# EAGLE design EV_Display_Schematic (EAGLE 9.6.2)
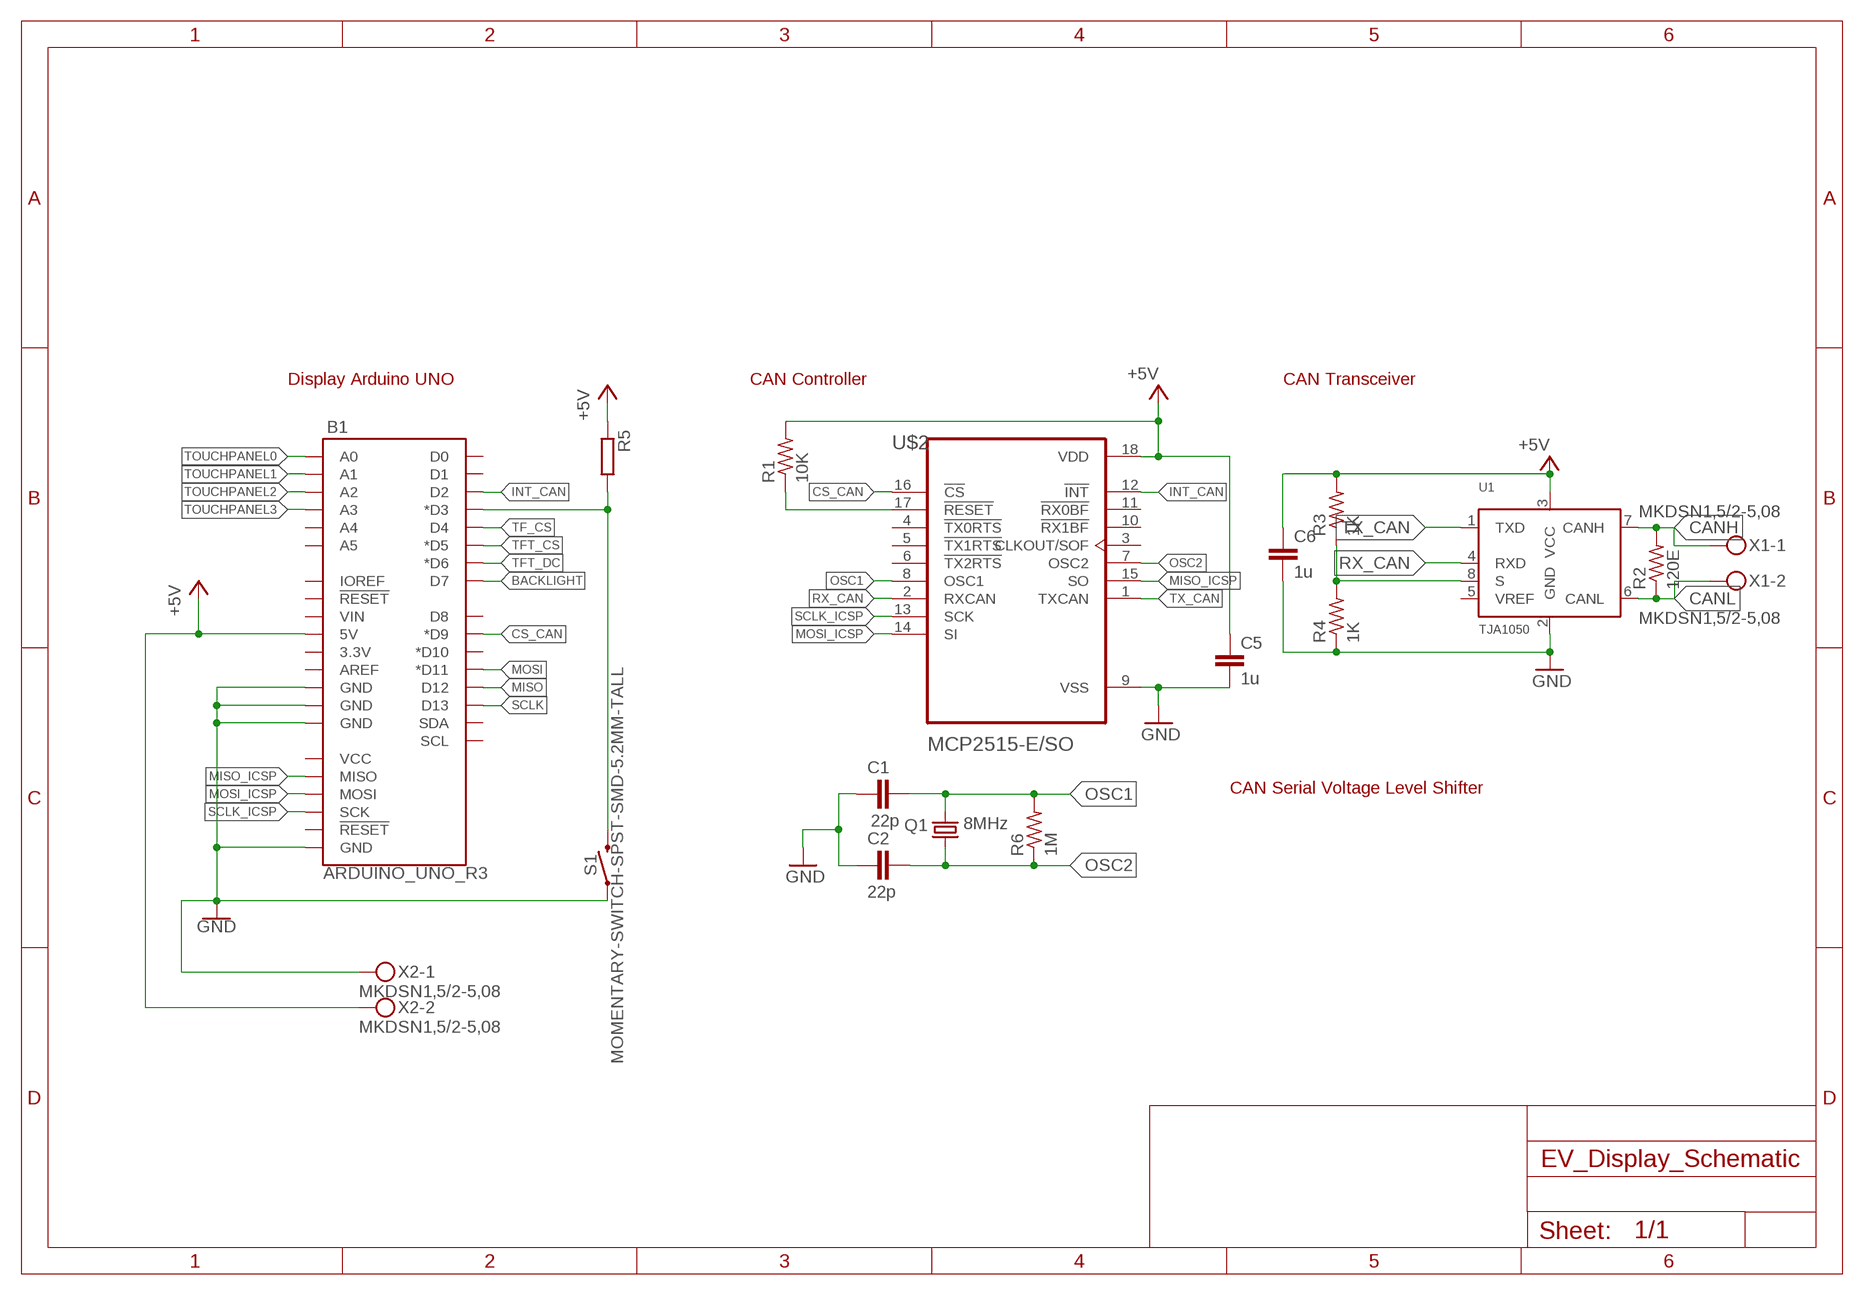
[diagram p0: schematic, sheet 1]

## Parts
B1  ARDUINO_UNO_R3  [ARDUINO_R3]
C1  22p  C-EUC0805  [C0805]
C2  22p  C-EUC0805  [C0805]
C5  1u  C-EUC0805  [C0805]
C6  1u  C-EUC0805  [C0805]
Q1  8MHz  CRYSTALHC49S  [HC49/S]
R1  10K  R-US_R0805  [R0805]
R2  120E  R-US_R0805  [R0805]
R3  1K  R-US_R0805  [R0805]
R4  1K  R-US_R0805  [R0805]
R5  R-EU_R0805  [R0805]
R6  1M  R-US_R0805  [R0805]
S1  MOMENTARY-SWITCH-SPST-SMD-5.2MM-TALL  [TACTILE_SWITCH_SMD_5.2MM]
U1  TJA1050  [SOT96-1]
U$2  MCP2515-E/SO  [SOIC127P1030X265-18N]
X1  MKDSN1,5/2-5,08  [MKDSN1,5/2-5,08]
X2  MKDSN1,5/2-5,08  [MKDSN1,5/2-5,08]

## Nets
+5V [Power]: B1.5V C5.1 C6.1 R1.2 R3.2 R5.1 U1.3(VCC) U$2.18(VDD) X2.2
BACKLIGHT: B1.D7
CANH: R2.2 U1.7(CANH) X1.1
CANL: R2.1 U1.6(CANL) X1.2
CS_CAN: B1.D9(*D9) U$2.16(!CS)
GND: B1.GND@1(GND) B1.GND@2(GND) B1.GND@3(GND) B1.GND@4(GND) C1.1 C2.1 C5.2 C6.2 R4.1 S1.1 U1.2(GND) U$2.9(VSS) X2.1
INT_CAN: B1.D2 U$2.12(!INT)
MISO: B1.D12
MISO_ICSP: B1.MISO U$2.15(SO)
MOSI: B1.D11(*D11)
MOSI_ICSP: B1.MOSI U$2.14(SI)
N$1: R1.1 U$2.17(!RESET)
N$2: R3.1 R4.2 U1.8(S)
N$3: B1.D3(*D3) R5.2 S1.3
OSC1: C1.2 Q1.2 R6.2 U$2.8(OSC1)
OSC2: C2.2 Q1.1 R6.1 U$2.7(OSC2)
RX_CAN: U1.4(RXD) U$2.2(RXCAN)
SCLK: B1.D13
SCLK_ICSP: B1.SCK U$2.13(SCK)
TF_CS: B1.D4
TFT_CS: B1.D5(*D5)
TFT_DC: B1.D6(*D6)
TOUCHPANEL0: B1.A0
TOUCHPANEL1: B1.A1
TOUCHPANEL2: B1.A2
TOUCHPANEL3: B1.A3
TX_CAN: U1.1(TXD) U$2.1(TXCAN)
Unconnected: B1.3.3V B1.A4 B1.A5 B1.AREF B1.D0 B1.D1 B1.D8 B1.D10(*D10) B1.IOREF B1.RESET@1(!RESET!) B1.RESET@2(!RESET!) B1.SCL B1.SDA B1.VCC B1.VIN U1.5(VREF) U$2.3(CLKOUT/SOF) U$2.4(!TX0RTS) U$2.5(!TX1RTS) U$2.6(!TX2RTS) U$2.10(!RX1BF) U$2.11(!RX0BF)

## Notes on the sheet
- Display Arduino UNO | CAN Controller | CAN Transceiver
- CAN Serial Voltage Level Shifter

## Library data of the parts
B1 = SparkFun-Boards:ARDUINO_UNO_R3: Arduino R3 Footprint with SPI header Arduino Uno R3 Compatible Footprint. Matches PCB size of the original board. SparkFun Products: SAMD21 Dev Breakout <https://www.sparkfun.com/products/13672> RedBoard <https://www.sparkfun.com/products/12757> R3 Stackable Headers <https://www.sparkfun.com/products/11417>
C1 C2 C5 C6 = rcl:C-EU: CAPACITOR, European symbol; SPICEPREFIX: C
Q1 = crystal:CRYSTAL: CRYSTAL; OC_FARNELL: 1667008; OC_NEWARK: unknown
R1-R4 R6 = rcl:R-US_: RESISTOR, American symbol; SPICEPREFIX: R
R5 = rcl:R-EU_: RESISTOR, European symbol; SPICEPREFIX: R
S1 = SparkFun-Switches:MOMENTARY-SWITCH-SPST: Momentary Switch (Pushbutton) - SPST Normally-open (NO) SPST momentary switches (buttons, pushbuttons). Variants PTH-12MM - 12mm square, through-hole Momentary Pushbutton Switch - 12mm Square <https://www.sparkfun.com/products/9190> (COM-09190) PTH-6.0MM, PTH-6.0MM-KIT - 6.0mm square, through-hole Mini Pushbutton Switch <https://www.sparkfun.com/products/97> (COM-00097) KIT package intended for soldering kit's - only one side of pads' copper is exposed. PTH-RIGHT-ANGLE-KIT - Right-angle, through-hole Right Angle Tactile Button <https://www.sparkfun.com/products/10791> - Used on SparkFun BigTime Watch Kit <https://www.sparkfun.com/products/11734> SMD-12MM - 12mm square, surface-mount Tactile Button - SMD (12mm) <https://www.sparkfun.com/products/12993> (COM-12993) Used on SparkFun PicoBoard <https://www.sparkfun.com/products/11888> SMD-4.5MM - 4.5mm Square Trackball Switch Used on SparkFun Blackberry Trackballer Breakout <https://www.sparkfun.com/products/13169> SMD-4.6MMX2.8MM - 4.60mm x 2.80mm, surface mount Used on SparkFun SAMD21 Mini Breakout <https://www.sparkfun.com/products/13664> SMD-5.2MM, SMD-5.2-REDUNDANT - 5.2mm square, surface-mount Mini Pushbutton Switch - SMD <https://www.sparkfun.com/products/8720> (COM-08720) Used on Arduino Pro Mini <https://www.sparkfun.com/products/11114> REDUNDANT package connects both switch circuits together SMD-6.0X3.5MM - 6.0 x 3.5mm, surface mount Momentary Reset Switch SMD <https://www.sparkfun.com/products/8229> (COM-08229) SMD-6.2MM-TALL - 6.2mm square, surface mount Tactile Button - SMD (6mm) <https://www.sparkfun.com/products/12992> Used on SparkFun Digital Sandbox <https://www.sparkfun.com/products/12651> SMD-RIGHT-ANGLE - Right-angle, surface mount Used on SparkFun Block for Intel® Edison - Arduino <https://www.sparkfun.com/products/13036>; PROD_ID: SWCH-14139
U1 = TJA1050:TJA1050: High speed CAN transceiver The TJA1050 is the interface between the Controller Area Network (CAN) protocol controller and the physical bus. The device provides differential transmit capability to the bus and differential receive capability to the CAN controller. The TJA1050 is the third Philips high-speed CAN transceiver after the PCA82C250 and the PCA82C251. The most important differences are: Much lower electromagnetic emission due to optimal matching of the output signals CANH and CANL Improved behaviour in case of an unpowered node No standby mode. This makes the TJA1050 eminently suitable for use in nodes that are in a power-down situation in partially powered networks. AAL Eindhoven MK; AVAILABILITY: Unavailable; DESCRIPTION: 1/1 Transceiver Half CANbus 8-SO; MF: NXP USA; MP: TJA1050; PACKAGE: SOIC-8 NXP USA; PRICE: None
U$2 = MCP2515-E_SO:MCP2515-E/SO; AVAILABILITY: Unavailable; DESCRIPTION: CANbus Controller CAN 2.0 SPI Interface 18-SOIC; MF: Microchip; MP: MCP2515-E/SO; PACKAGE: SOIC-18 Microchip; PRICE: None
X1 X2 = con-phoenix-508:MKDSN1,5/2-5,08: MKDSN 1,5/ 2-5,08 Printklemme Nennstrom: 13,5 A Nennspannung: 250 V Rastermaß: 5,08 mm Polzahl: 2 Anschlussart: Schraubanschluss Montage: Löten Anschlussrichtung Leiter/Platine: 0 ° Artikelnummer: 1729128 Source: http://eshop.phoenixcontact.com .. 1729128.pdf

## Net classes
0 default: width 0.305 mm, clearance 0.203 mm
1 Power: width 0.508 mm, clearance 0.406 mm

## Board
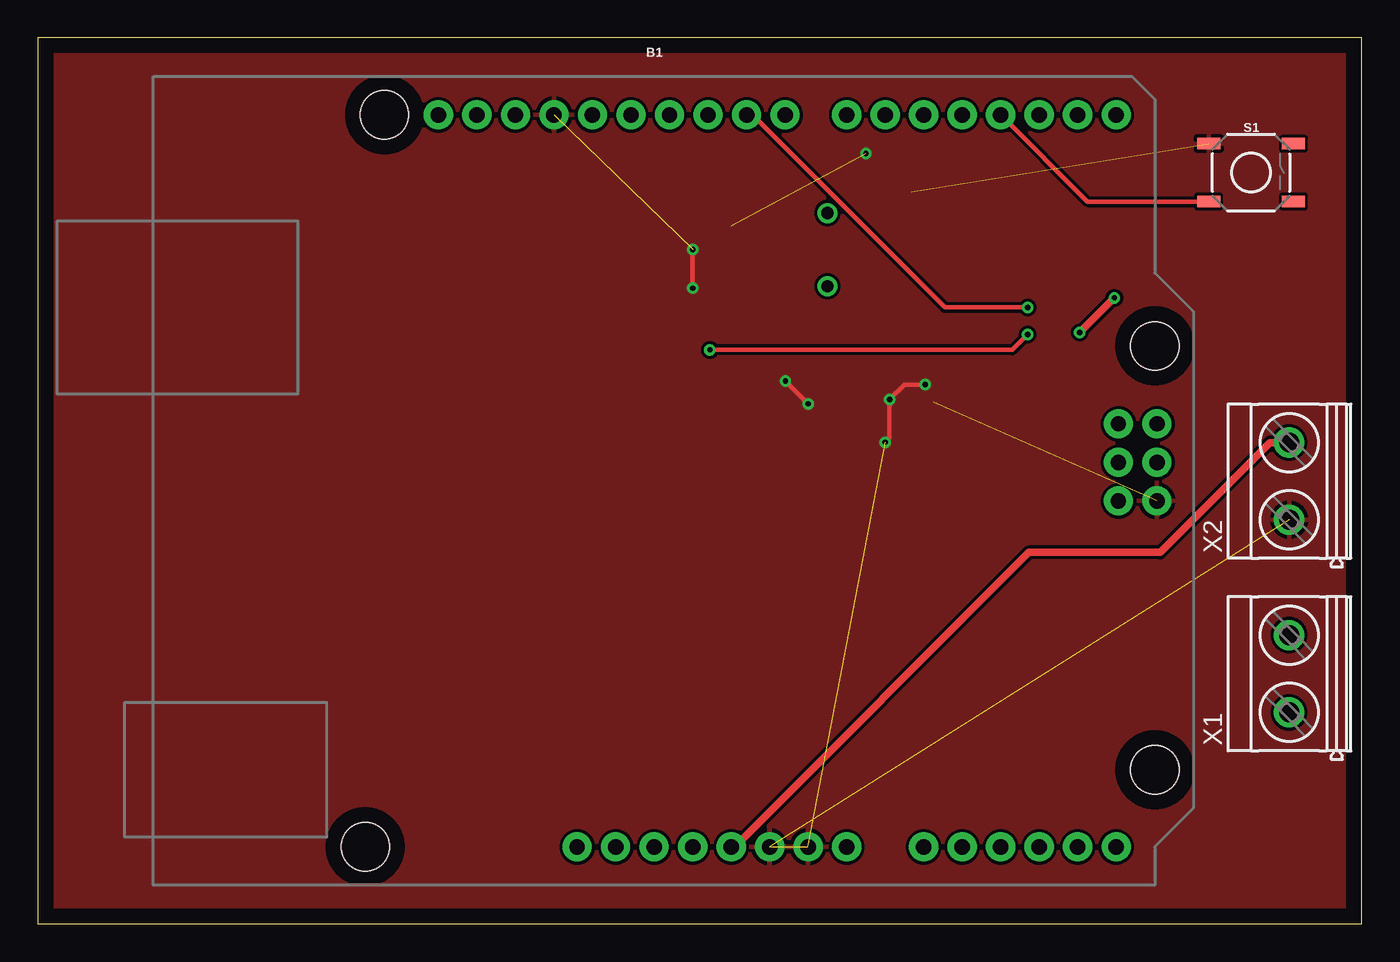
[diagram p1: board, top side]
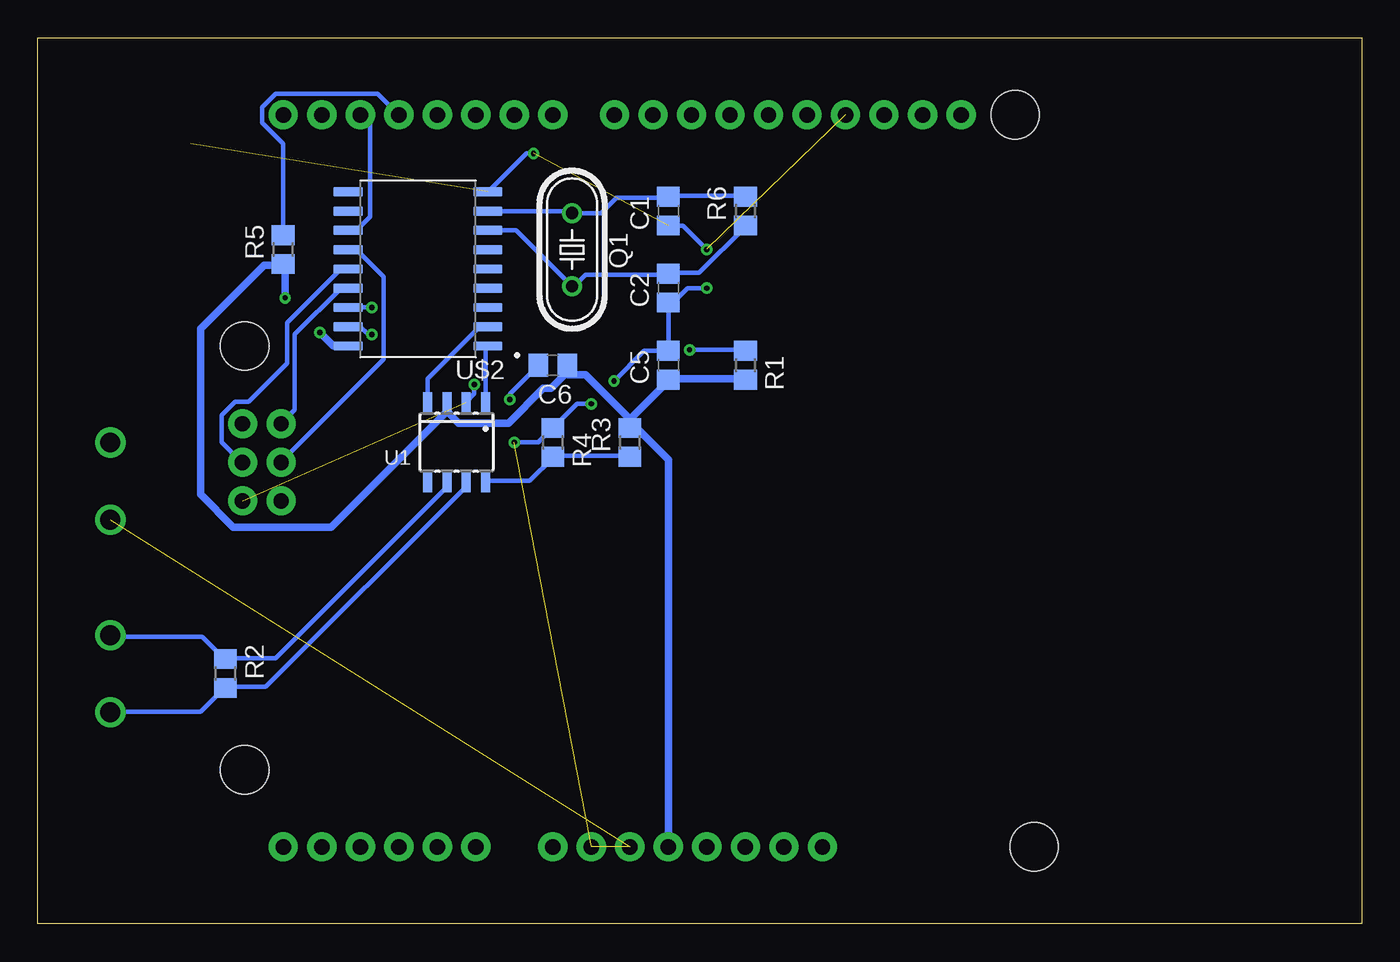
[diagram p2: board, bottom side, seen from below]

Size 87.3 x 58.41 mm. Coordinates in mm from the lower left corner, seen from the top.
Outline: 0,0 87.3,0 87.3,58.41 0,58.41 0,0
Copper layers (1*16): Top 0.035mm / dielectric 1.5mm / Bottom 0.035mm
Design rules "default": minimum track width 6mil, minimum drill 0.35mm, track to track 6mil, track to pad 6mil, pad to pad 6mil, via to via 6mil, smd to smd 6mil, copper to edge 40mil, drill to drill 6mil, minimum pad ring 10mil, minimum via ring 8mil, stop-mask expansion 4mil, vias tented up to drill 0mil, thermal gap 10mil

### Footprints (pad centres in the part's own frame; a part is rotated, then mirrored left to right if it is on the bottom)
ARDUINO_R3 = drill 1.016 pad 1.93: 3.3V 2.54,-24.13; 5V 5.08,-24.13; A0 17.78,-24.13; A1 20.32,-24.13; A2 22.86,-24.13; A3 25.4,-24.13; A4 27.94,-24.13; A5 30.48,-24.13; AREF -9.144,24.13; D0 30.48,24.13; D1 27.94,24.13; D2 25.4,24.13; D3 22.86,24.13; D4 20.32,24.13; D5 17.78,24.13; D6 15.24,24.13; D7 12.7,24.13; D8 8.636,24.13; D9 6.096,24.13; D10 3.556,24.13; D11 1.016,24.13; D12 -1.524,24.13; D13 -4.064,24.13; GND@1 7.62,-24.13; GND@2 10.16,-24.13; GND@3 -6.604,24.13; GND@4 33.16,-1.32; IOREF -2.54,-24.13; MISO 30.62,3.76; MOSI 33.16,1.22; NC -5.08,-24.13; RESET@1 0,-24.13; RESET@2 30.62,-1.32; SCK 30.62,1.22; SCL -14.224,24.13; SDA -11.684,24.13; VCC 33.16,3.76; VIN 12.7,-24.13 | hole 3.175: -17.78,24.13; 33.02,8.89; 33.02,-19.05; -19.05,-24.13
C0805 = smd 1.3 x 1.5: 1 -0.95,0; 2 0.95,0
HC49/S = drill 0.813: 1 -2.413,0; 2 2.413,0
R0805 = smd 1.3 x 1.5: 1 -0.95,0; 2 0.95,0
TACTILE_SWITCH_SMD_5.2MM = smd 1.524 x 0.762: 1 -2.794,1.905; 2 2.794,1.905; 3 -2.794,-1.905; 4 2.794,-1.905
SOT96-1 = smd 0.6 x 1.3: 1 -1.905,-2.65; 2 -0.635,-2.65; 3 0.635,-2.65; 4 1.905,-2.65; 5 1.905,2.65; 6 0.635,2.65; 7 -0.635,2.65; 8 -1.905,2.65
SOIC127P1030X265-18N = smd 1.91 x 0.6: 1 -4.61,5.08; 2 -4.61,3.81; 3 -4.61,2.54; 4 -4.61,1.27; 5 -4.61,0; 6 -4.61,-1.27; 7 -4.61,-2.54; 8 -4.61,-3.81; 9 -4.61,-5.08; 10 4.61,-5.08; 11 4.61,-3.81; 12 4.61,-2.54; 13 4.61,-1.27; 14 4.61,0; 15 4.61,1.27; 16 4.61,2.54; 17 4.61,3.81; 18 4.61,5.08
MKDSN1,5/2-5,08 = drill 1.3 pad 2: 1 -2.561,0.025; 2 2.519,0.025

### Placement (x,y rotation side)
B1  40.64,29.21 0 top
C1  45.72,46.99 90 bottom
C2  45.72,41.91 90 bottom
C5  45.72,36.83 90 bottom
C6  53.34,36.83 180 bottom
Q1  52.07,44.45 90 bottom
R1  40.64,36.83 270 bottom
R2  74.93,16.51 270 bottom
R3  48.26,31.75 90 bottom
R4  53.34,31.75 270 bottom
R5  71.12,44.45 90 bottom
R6  40.64,46.99 90 bottom
S1  80.01,49.53 0 top
U1  59.69,31.75 180 bottom
U$2  62.23,43.18 180 bottom
X1  82.55,16.51 90 top
X2  82.55,29.21 90 top

### Tracks (layer width: path | path; a pad name or v marks a point on that pad's centre or on a via)
+5V  (via drill 0.35)
  Top 0.508: v70.99,41.27 v68.71,38.99 | X2.2 81.25,31.73 74.01,24.49 65.37,24.49 45.96,5.08 B1.5V
  Bottom 0.508: 60.33,33.78 U1.3 | 60.33,33.78 59.56,33.02 56.26,33.02 53.98,35.31 53.47,35.31 52.45,36.32 52.45,36.83 C6.1 52.32,36.2 51.18,36.2 48.26,33.27 | 60.33,33.78 67.94,26.16 74.42,26.16 76.58,28.32 76.58,39.24 72.39,43.43 71.12,43.43 R5.1 70.99,43.31 v70.99,41.27 | U$2.18 67.82,38.1 v68.71,38.99 | R1.2 40.64,35.94 45.72,35.94 C5.1 45.85,35.69 48.26,33.27 | 48.26,33.27 R3.2 48.13,32.51 47.62,32.51 45.72,30.61 B1.5V
CANH
  Bottom 0.305: U1.7 59.05,28.83 72.26,15.62 74.93,15.62 R2.2 75.06,15.49 76.58,13.97 82.42,13.97 X1.1
CANL
  Bottom 0.305: U1.6 60.33,28.83 71.63,17.53 74.93,17.53 R2.1 75.06,17.53 76.45,18.92 82.42,18.92 X1.2
CS_CAN  (via drill 0.35)
  Top 0.305: v65.28,40.64 59.82,40.64 47.12,53.34 B1.D9
  Bottom 0.305: v65.28,40.64 U$2.16
GND  (via drill 0.35)  (7 unrouted)
  Top 0.305: v50.8,34.29 v49.3,35.79 | v43.19,44.46 v43.18,44.45 v43.18,41.91 | v55.88,31.75 56.17,32.04 v56.17,34.58 57.15,35.56 v58.52,35.56
  Bottom 0.305: v49.3,35.79 47.31,37.78 C5.2 45.72,40.64 | C2.1 45.72,40.64 | C1.1 44.77,46.04 v43.19,44.46 | v43.18,41.91 44.45,41.91 45.72,40.64 | C6.2 56.17,34.95 v56.17,34.58 | v55.88,31.75 54.29,31.75 54.24,31.81 54.23,31.81 R4.1 51.75,34.29 v50.8,34.29 | v58.52,35.56 58.52,34.94 U1.2 | U$2.9 55.08,50.8 v54.61,50.8
  pour Top: 0,58.42 87.63,58.42 87.63,0 0,0
INT_CAN
  Bottom 0.305: U$2.12 66.29,45.72 65.41,46.61 65.41,52.7 B1.D2
MISO_ICSP
  Bottom 0.305: U$2.15 67.31,41.91 70.36,38.86 70.36,33.91 71.25,33.02 B1.MISO
MOSI_ICSP
  Bottom 0.305: U$2.14 67.31,43.18 70.87,39.62 70.87,36.96 73.41,34.42 74.3,34.42 75.18,33.53 75.18,31.75 73.91,30.48 B1.MOSI
N$1  (via drill 0.35)
  Top 0.305: v44.32,37.85 64.26,37.85 v65.28,38.86
  Bottom 0.305: v44.32,37.85 40.64,37.85 R1.1 | v65.28,38.86 65.53,38.86 66.04,39.37 U$2.17
N$2
  Bottom 0.305: U1.8 57.78,29.21 54.86,29.21 53.34,30.73 R4.2 53.21,30.86 48.26,30.86 R3.1
N$3
  Top 0.305: S1.3 69.22,47.62 B1.D3
  Bottom 0.305: R5.2 71.12,51.44 72.52,52.83 72.52,53.85 71.63,54.74 64.9,54.74 B1.D3
OSC1
  Bottom 0.305: R6.2 40.64,48.01 45.72,48.01 C1.2 45.85,47.88 49.15,47.88 50.16,46.86 Q1.2 52.2,46.99 U$2.8
OSC2
  Bottom 0.305: R6.1 40.64,45.97 43.69,42.93 45.72,42.93 C2.2 45.85,42.8 51.18,42.8 51.94,42.04 Q1.1 55.75,45.72 U$2.7
RX_CAN
  Bottom 0.305: U1.4 61.59,35.94 58.17,39.37 U$2.2
SCLK_ICSP
  Bottom 0.305: U$2.13 66.29,44.45 64.52,42.67 64.52,37.21 71.25,30.48 B1.SCK
TX_CAN
  Bottom 0.305: U1.1 57.78,37.97 57.66,38.1 U$2.1